# Altium schematic sheet Micro.SchDoc
size A; SheetNumber: 2; SheetTotal: 3
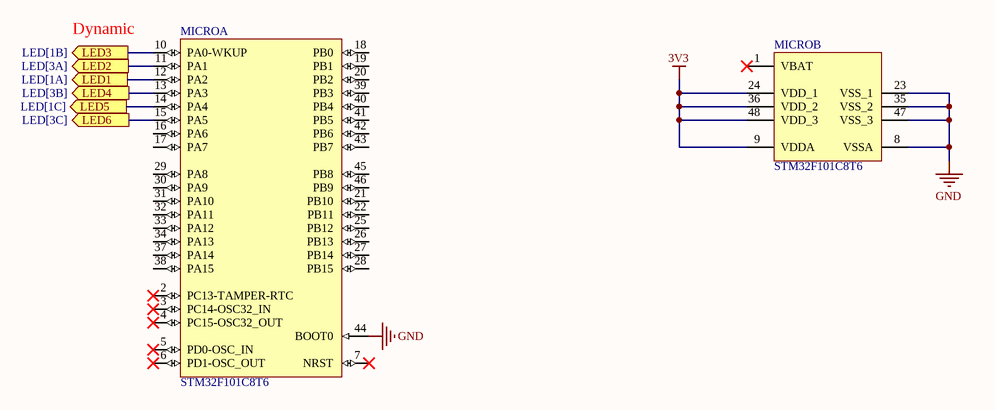
[diagram p0: Micro.SchDoc]

## Parts
MICRO  STM32F101C8T6  [STM-LQFP48_N]  (parts A,B of 2)

## Ports
LED1 (out, see LED[1A]), LED2 (out, see LED[3A]), LED3 (out, see LED[1B]), LED4 (out, see LED[3B]), LED5 (out, see LED[1C]), LED6 (out, see LED[3C])

## Nets
3V3: MICRO.9(VDDA) MICRO.24(VDD_1) MICRO.36(VDD_2) MICRO.48(VDD_3)
GND: MICRO.8(VSSA) MICRO.23(VSS_1) MICRO.35(VSS_2) MICRO.44(BOOT0) MICRO.47(VSS_3)
LED1: MICRO.12(PA2) ; port LED1
LED2: MICRO.11(PA1) ; port LED2
LED3: MICRO.10(PA0-WKUP) ; port LED3
LED4: MICRO.13(PA3) ; port LED4
LED5: MICRO.14(PA4) ; port LED5
LED6: MICRO.15(PA5) ; port LED6

Not connected (* = marked no-connect by the designer): MICRO 1(VBAT)* 2(PC13-TAMPER-RTC)* 3(PC14-OSC32_IN)* 4(PC15-OSC32_OUT)* 5(PD0-OSC_IN)* 6(PD1-OSC_OUT)* 7(NRST)* 16(PA6) 17(PA7) 18(PB0) 19(PB1) 20(PB2) 21(PB10) 22(PB11) 25(PB12) 26(PB13) 27(PB14) 28(PB15) 29(PA8) 30(PA9) 31(PA10) 32(PA11) 33(PA12) 34(PA13) 37(PA14) 38(PA15) 39(PB3) 40(PB4) 41(PB5) 42(PB6) 43(PB7) 45(PB8) 46(PB9)

## Notes on the sheet
- (near MICRO) Dynamic

## Library data of the parts
MICRO = STM32F101C8T6: ARM Cortex-M3 32-bit MCU, 64 KB Flash, 10 KB Internal RAM, 37 I/Os, 48-pin LQFP, -40 to 85 degC, Tray; A/D Converter: 1x12-bit (10 Channel); FLASH Size (Prog) (kB): 64; I/Os (High Current): 37; Internal RAM Size (kB): 10; Operating Frequency(F) (Processor speed) (MHz): 36; Supply Voltage(Vcc) min (V): 2; DatasheetVersion: Rev. 16; PackageVersion: Rev. 6, 06/2013; PackageReference: LQFP48; PackageDescription: 48-Pin Low Profile Quad Flat Package, 7 x 7 mm Body, 0.5 mm Pitch; Supplier 1: Digi-Key; Supplier Part Number 1: 497-6055-ND; Supplier 2: Farnell; Supplier Part Number 2: 1447629; Supplier 3: Newark; Supplier Part Number 3: 57P1185; Supplier 4: Mouser; Supplier Part Number 4: 511-STM32F101C8T6; Core: ARM Cortex-M3; Packing: Tray; Mounting Technology: Surface Mount; PartNumber: STM32F101C8T6; ComponentLink1Description: Manufacturer URL; ComponentLink1URL: http://www.st.com/web/en/home.html; ComponentLink2Description: Datasheet; ComponentLink2URL: http://www.st.com/st-web-ui/static/active/en/resource/technical/document/datasheet/CD00161561.pdf; ComponentLink3Description: Package Specification; ComponentLink3URL: http://www.st.com/st-web-ui/static/active/en/resource/technical/document/datasheet/DM00058181.pdf